# EAGLE design DigitalOut-02 (EAGLE 6.2)
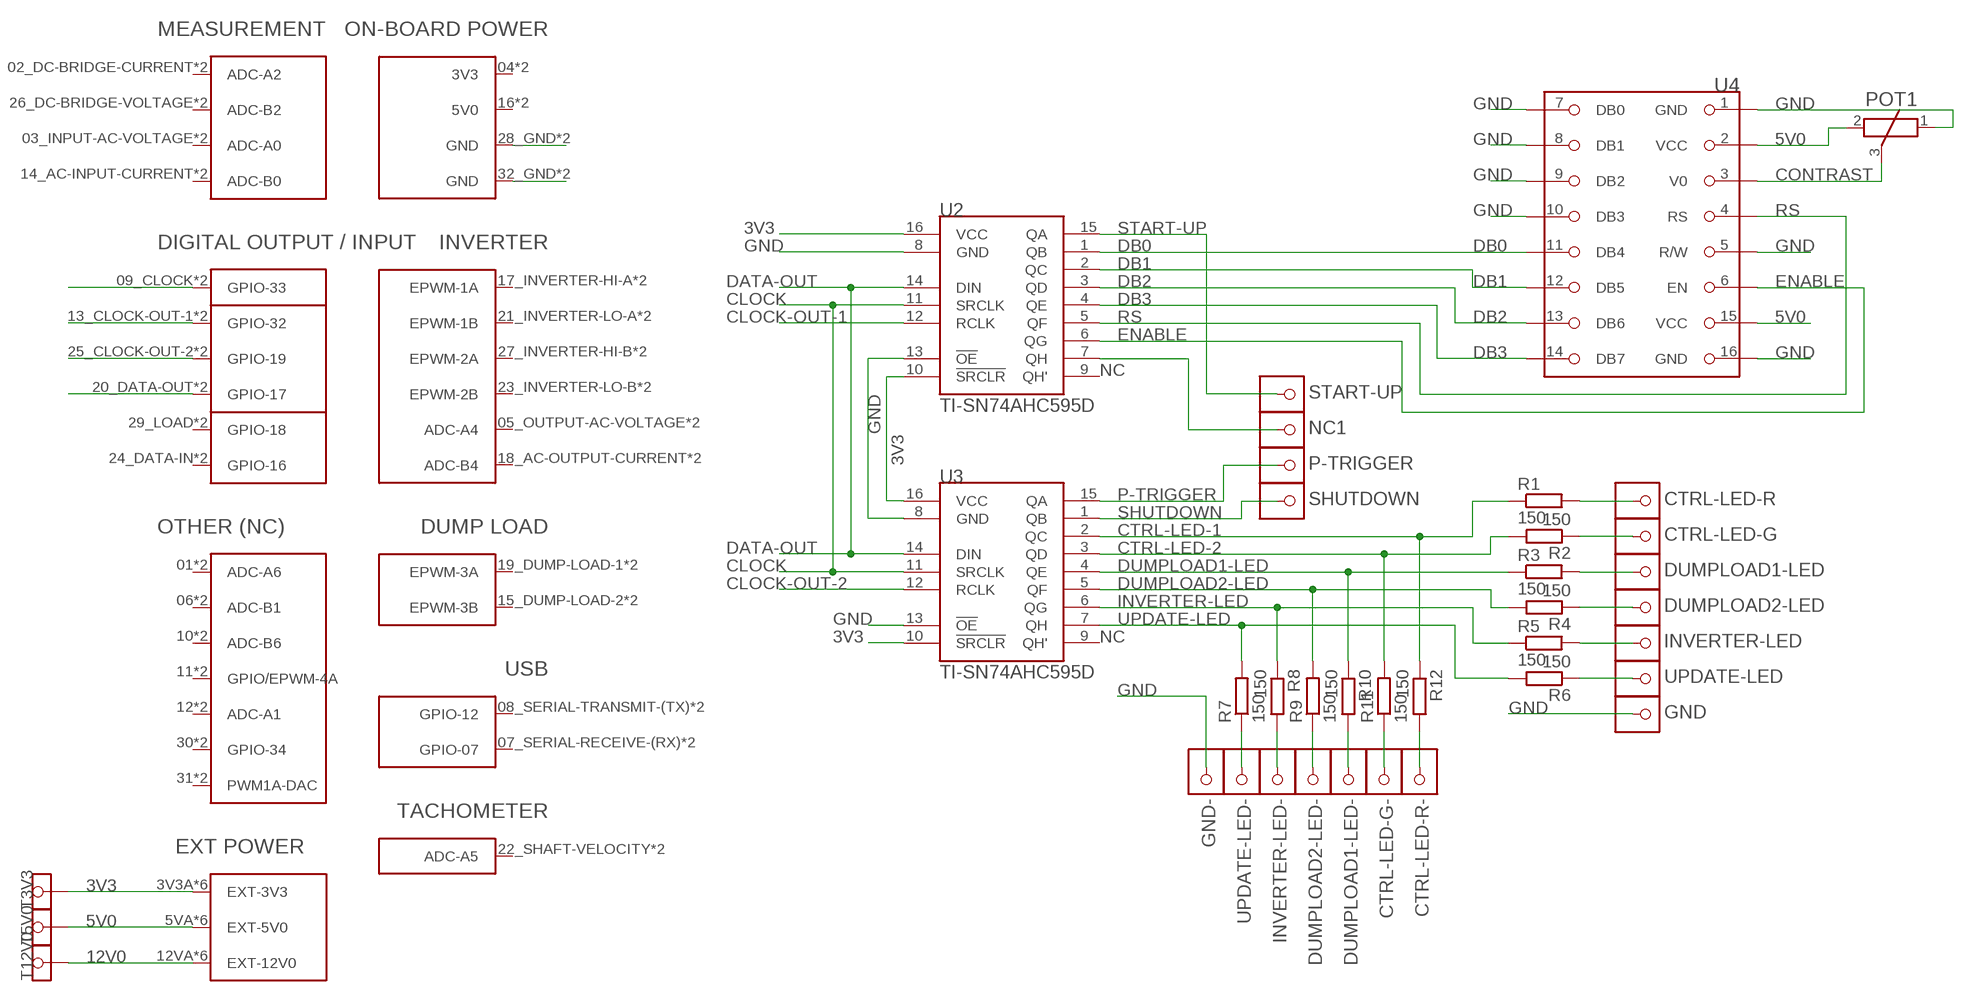
[diagram p0: schematic, sheet 1]

## Parts
CTRL-LED-G  1X1HEADER(W/VIA)  [1X1HEADER(W/VIA)]
CTRL-LED-G-  1X1HEADER  [1X1HEADER]
CTRL-LED-R  1X1HEADER(W/VIA)  [1X1HEADER(W/VIA)]
CTRL-LED-R-  1X1HEADER  [1X1HEADER]
DUMPLOAD1-LED  1X1HEADER(W/VIA)  [1X1HEADER(W/VIA)]
DUMPLOAD1-LED-  1X1HEADER  [1X1HEADER]
DUMPLOAD2-LED  1X1HEADER(W/VIA)  [1X1HEADER(W/VIA)]
DUMPLOAD2-LED-  1X1HEADER  [1X1HEADER]
GND  1X1HEADER(W/VIA)  [1X1HEADER(W/VIA)]
GND-  1X1HEADER  [1X1HEADER]
INVERTER-LED  1X1HEADER(W/VIA)  [1X1HEADER(W/VIA)]
INVERTER-LED-  1X1HEADER  [1X1HEADER]
NC1  1X1HEADER(W/VIA)  [1X1HEADER(W/VIA)]
P-TRIGGER  1X1HEADER(W/VIA)  [1X1HEADER(W/VIA)]
POT1  BOURNS-3361S  [BOURNS-3361S]
R1  150  R-EU_R0805  [R0805]
R2  150  R-EU_R0805  [R0805]
R3  150  R-EU_R0805  [R0805]
R4  150  R-EU_R0805  [R0805]
R5  150  R-EU_R0805  [R0805]
R6  150  R-EU_R0805  [R0805]
R7  150  R-EU_R0805  [R0805]
R8  150  R-EU_R0805  [R0805]
R9  150  R-EU_R0805  [R0805]
R10  150  R-EU_R0805  [R0805]
R11  150  R-EU_R0805  [R0805]
R12  150  R-EU_R0805  [R0805]
SHUTDOWN  1X1HEADER(W/VIA)  [1X1HEADER(W/VIA)]
START-UP  1X1HEADER(W/VIA)  [1X1HEADER(W/VIA)]
T3V3  TESTPAD  [TESTPAD]
T5V0  TESTPAD  [TESTPAD]
T12V0  TESTPAD  [TESTPAD]
U1  CONTROLLER_STACK  [CONTROLLER_STACK]
U2  TI-SN74AHC595D  [SOIC-16D]
U3  TI-SN74AHC595D  [SOIC-16D]
U4  MULTICOMP-MC9B232  [MULTICOMP-MC9B232]
UPDATE-LED  1X1HEADER(W/VIA)  [1X1HEADER(W/VIA)]
UPDATE-LED-  1X1HEADER  [1X1HEADER]

## Nets
3V3: T3V3.TP U1.3V3A(EXT-3V3) U1.3V3B(EXT-3V3) U1.3V3C(EXT-3V3) U1.3V3D(EXT-3V3) U1.3V3E(EXT-3V3) U1.3V3F(EXT-3V3) U2.10(!SRCLR) U2.16(VCC) U3.10(!SRCLR) U3.16(VCC)
5V0: POT1.2 T5V0.TP U1.5VA(EXT-5V0) U1.5VB(EXT-5V0) U1.5VC(EXT-5V0) U1.5VD(EXT-5V0) U1.5VE(EXT-5V0) U1.5VF(EXT-5V0) U4.2(VCC) U4.15(VCC)
12V0: T12V0.TP U1.12VA(EXT-12V0) U1.12VB(EXT-12V0) U1.12VC(EXT-12V0) U1.12VD(EXT-12V0) U1.12VE(EXT-12V0) U1.12VF(EXT-12V0)
CLOCK: U1.09_CLOCK(GPIO-33) U1.C9(GPIO-33) U2.11(SRCLK) U3.11(SRCLK)
CLOCK-OUT-1: U1.13_CLOCK-OUT-1(GPIO-32) U1.C13(GPIO-32) U2.12(RCLK)
CLOCK-OUT-2: U1.25_CLOCK-OUT-2(GPIO-19) U1.C25(GPIO-19) U3.12(RCLK)
CONTRAST: POT1.3 U4.3(V0)
CTRL-LED-1: R1.1 R12.1 U3.2(QC)
CTRL-LED-2: R2.2 R11.2 U3.3(QD)
DATA-OUT: U1.20_DATA-OUT(GPIO-17) U1.C20(GPIO-17) U2.14(DIN) U3.14(DIN)
DB0: U2.1(QB) U4.11(DB4)
DB1: U2.2(QC) U4.12(DB5)
DB2: U2.3(QD) U4.13(DB6)
DB3: U2.4(QE) U4.14(DB7)
DUMPLOAD1-LED: R3.1 R10.1 U3.4(QE)
DUMPLOAD2-LED: R4.2 R9.2 U3.5(QF)
ENABLE: U2.6(QG) U4.6(EN)
GND: GND-.P$1 GND.P$2 GND.P$3 GND.P$4 GND.PAD POT1.1 U1.28_GND(GND) U1.32_GND(GND) U1.C28(GND) U1.C32(GND) U2.8(GND) U2.13(!OE) U3.8(GND) U3.13(!OE) U4.1(GND) U4.5(R/W) U4.7(DB0) U4.8(DB1) U4.9(DB2) U4.10(DB3) U4.16(GND)
INVERTER-LED: R5.1 R8.1 U3.6(QG)
N$1: R7.1 UPDATE-LED-.P$1
N$2: INVERTER-LED-.P$1 R8.2
N$7: DUMPLOAD2-LED-.P$1 R9.1
N$8: DUMPLOAD1-LED-.P$1 R10.2
N$9: CTRL-LED-G-.P$1 R11.1
N$10: CTRL-LED-R.P$2 CTRL-LED-R.P$3 CTRL-LED-R.P$4 CTRL-LED-R.PAD R1.2
N$11: CTRL-LED-R-.P$1 R12.2
N$12: CTRL-LED-G.P$2 CTRL-LED-G.P$3 CTRL-LED-G.P$4 CTRL-LED-G.PAD R2.1
N$13: DUMPLOAD1-LED.P$2 DUMPLOAD1-LED.P$3 DUMPLOAD1-LED.P$4 DUMPLOAD1-LED.PAD R3.2
N$14: DUMPLOAD2-LED.P$2 DUMPLOAD2-LED.P$3 DUMPLOAD2-LED.P$4 DUMPLOAD2-LED.PAD R4.1
N$15: NC1.P$2 NC1.P$3 NC1.P$4 NC1.PAD U2.7(QH)
N$16: INVERTER-LED.P$2 INVERTER-LED.P$3 INVERTER-LED.P$4 INVERTER-LED.PAD R5.2
N$17: R6.1 UPDATE-LED.P$2 UPDATE-LED.P$3 UPDATE-LED.P$4 UPDATE-LED.PAD
P-TRIGGER: P-TRIGGER.P$2 P-TRIGGER.P$3 P-TRIGGER.P$4 P-TRIGGER.PAD U3.15(QA)
RS: U2.5(QF) U4.4(RS)
SHUTDOWN: SHUTDOWN.P$2 SHUTDOWN.P$3 SHUTDOWN.P$4 SHUTDOWN.PAD U3.1(QB)
START-UP: START-UP.P$2 START-UP.P$3 START-UP.P$4 START-UP.PAD U2.15(QA)
UPDATE-LED: R6.2 R7.2 U3.7(QH)
Unconnected: U1.01(ADC-A6) U1.02_DC-BRIDGE-CURRENT(ADC-A2) U1.03_INPUT-AC-VOLTAGE(ADC-A0) U1.04(3V3) U1.05_OUTPUT-AC-VOLTAGE(ADC-A4) U1.06(ADC-B1) U1.07_SERIAL-RECEIVE-(RX)(GPIO-07) U1.08_SERIAL-TRANSMIT-(TX)(GPIO-12) U1.10(ADC-B6) U1.11(GPIO/EPWM-4A) U1.12(ADC-A1) U1.14_AC-INPUT-CURRENT(ADC-B0) U1.15_DUMP-LOAD-2(EPWM-3B) U1.16(5V0) U1.17_INVERTER-HI-A(EPWM-1A) U1.18_AC-OUTPUT-CURRENT(ADC-B4) U1.19_DUMP-LOAD-1(EPWM-3A) U1.21_INVERTER-LO-A(EPWM-1B) U1.22_SHAFT-VELOCITY(ADC-A5) U1.23_INVERTER-LO-B(EPWM-2B) U1.24_DATA-IN(GPIO-16) U1.26_DC-BRIDGE-VOLTAGE(ADC-B2) U1.27_INVERTER-HI-B(EPWM-2A) U1.29_LOAD(GPIO-18) U1.30(GPIO-34) U1.31(PWM1A-DAC) U1.C1(ADC-A6) U1.C2(ADC-A2) U1.C3(ADC-A0) U1.C4(3V3) U1.C5(ADC-A4) U1.C6(ADC-B1) U1.C7(GPIO-07) U1.C8(GPIO-12) U1.C10(ADC-B6) U1.C11(GPIO/EPWM-4A) U1.C12(ADC-A1) U1.C14(ADC-B0) U1.C15(EPWM-3B) U1.C16(5V0) U1.C17(EPWM-1A) U1.C18(ADC-B4) U1.C19(EPWM-3A) U1.C21(EPWM-1B) U1.C22(ADC-A5) U1.C23(EPWM-2B) U1.C24(GPIO-16) U1.C26(ADC-B2) U1.C27(EPWM-2A) U1.C29(GPIO-18) U1.C30(GPIO-34) U1.C31(PWM1A-DAC) U2.9(QH') U3.9(QH')

## Notes on the sheet
- NC
- NC

## Library data of the parts
CTRL-LED-G CTRL-LED-R DUMPLOAD1-LED DUMPLOAD2-LED GND INVERTER-LED NC1 P-TRIGGER SHUTDOWN START-UP UPDATE-LED = headers v6-2:1X1HEADER(W/VIA)
CTRL-LED-G- CTRL-LED-R- DUMPLOAD1-LED- DUMPLOAD2-LED- GND- INVERTER-LED- UPDATE-LED- = headers v6-2:1X1HEADER: Standard 1x1way male/female header. 2.54mm pitch. Through-Hole. Use to create custom length headers by stacking.
POT1 = PCB_ControlStack:BOURNS-3361S
R1-R12 = resistor:R-EU_: RESISTOR, European symbol
T3V3 T5V0 T12V0 = PCB_ControlStack:TESTPAD
U1 = PCB_ControlStack:CONTROLLER_STACK
U2 U3 = PCB_ControlStack:TI-SN74AHC595D: Texas Instruments SN74HC595D Serial-to-Parallel Shift Register, 8 bit with storage register, Tri-state
U4 = PCB_ControlStack:MULTICOMP-MC9B232: A shrouded lock header for LCD screen interfacing. 2.54mm pitch.

## Board
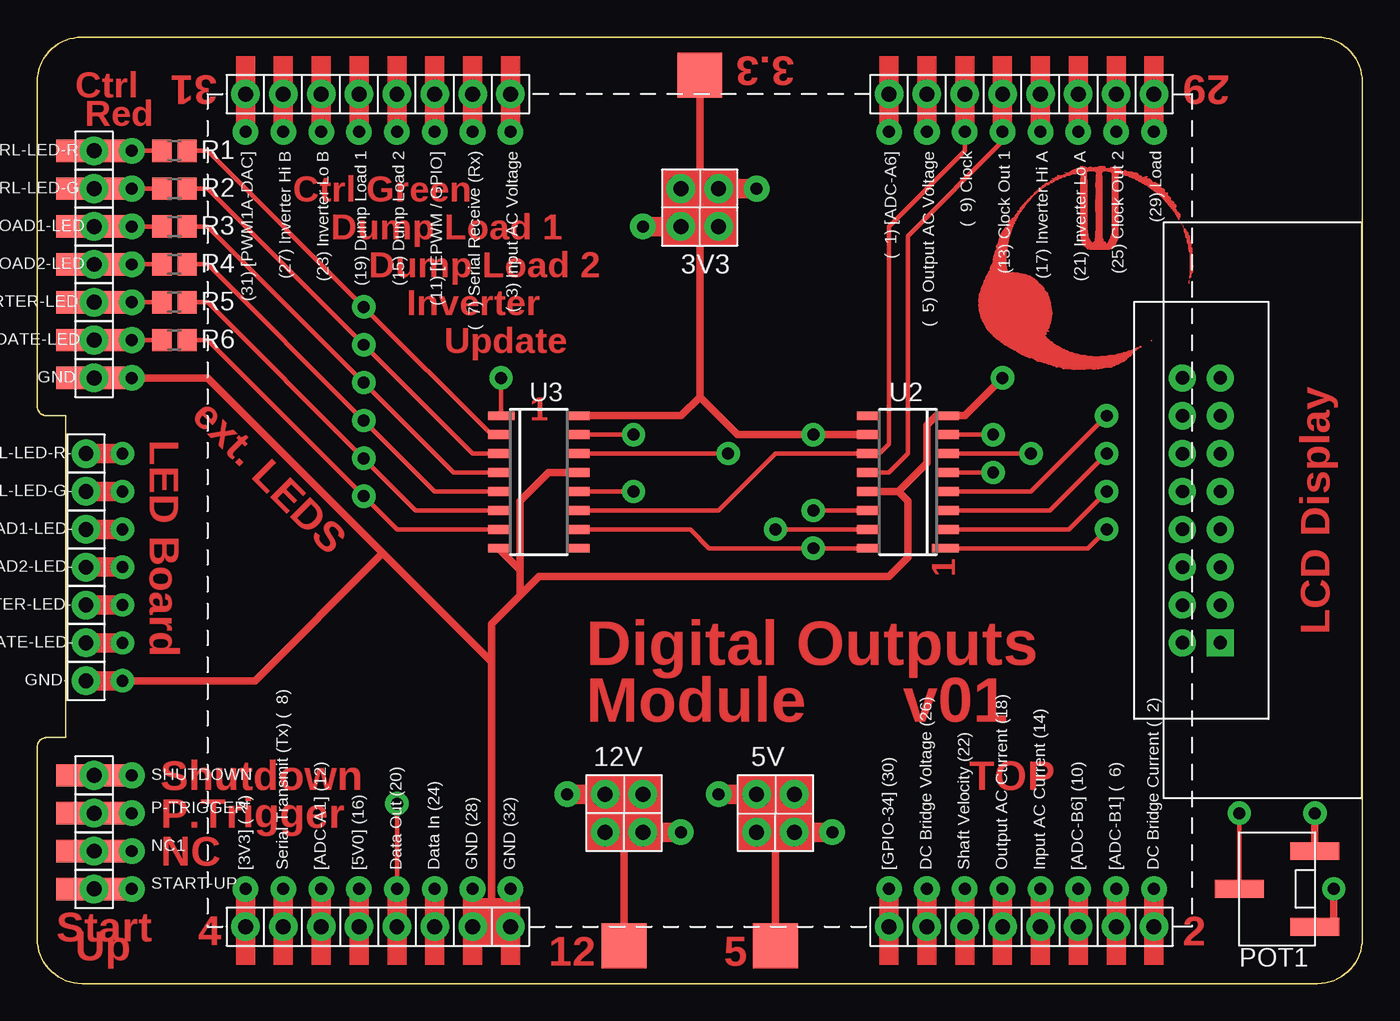
[diagram p1: board, top side]
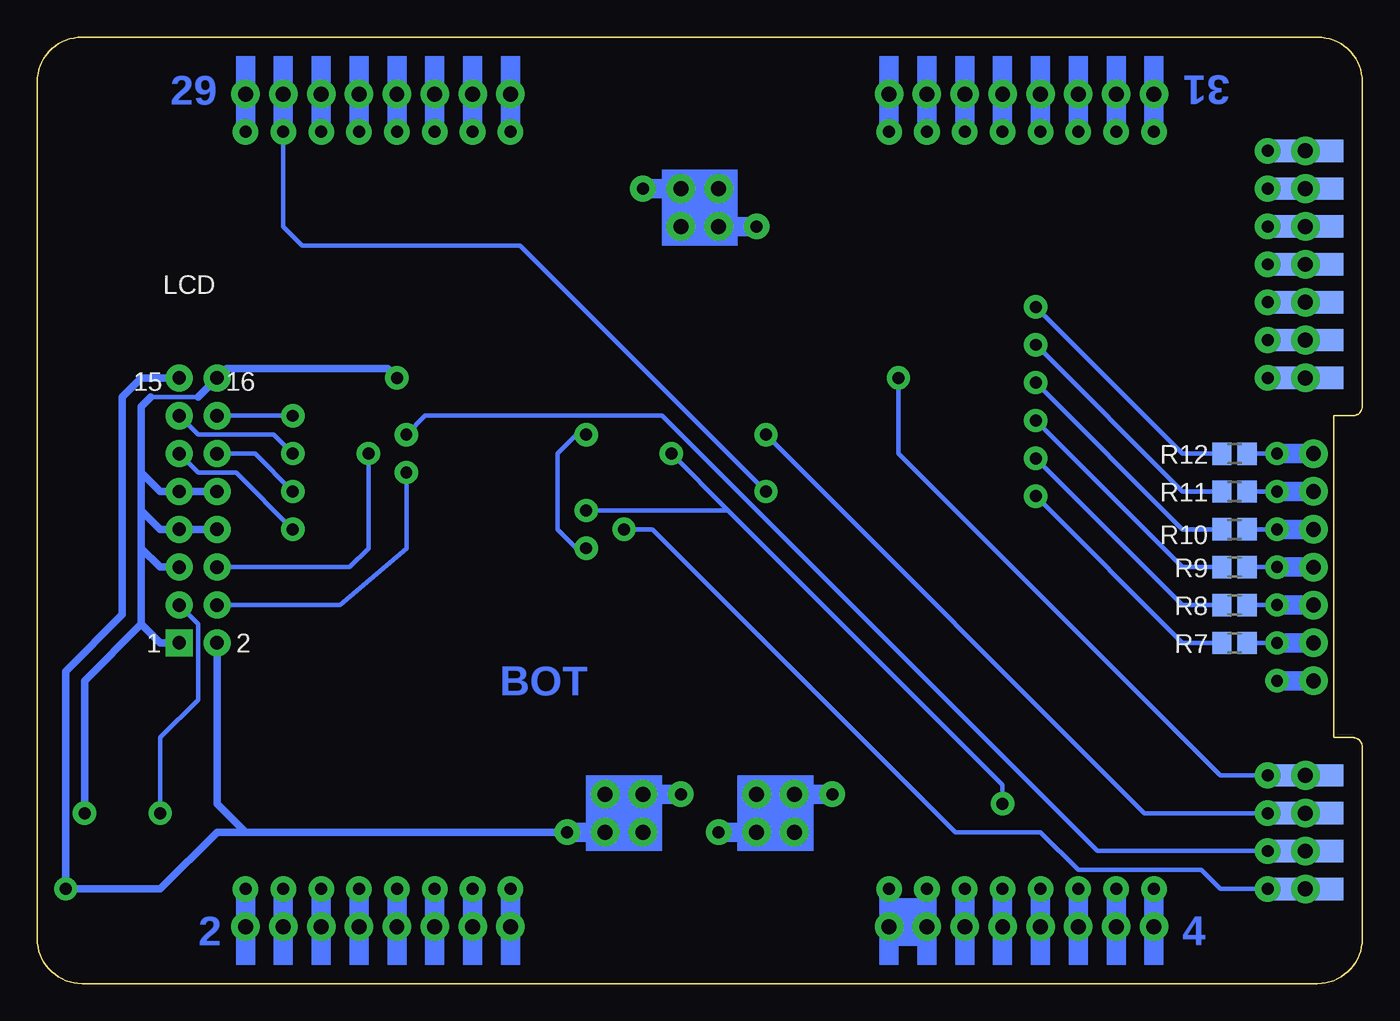
[diagram p2: board, bottom side, seen from below]

Size 88.9 x 63.5 mm. Coordinates in mm from the lower left corner, seen from the top.
Outline: 3,0 85.9,0 arc90 88.9,3 88.9,60.5 arc90 85.9,63.5 3,63.5 arc90 0,60.5 0,38.73 arc90 0.64,38.1 1.91,38.1 1.91,16.51 0.64,16.51 arc90 0,15.88 0,3 arc90 3,0
Copper layers (1*16): Top 0.035mm / dielectric 1.5mm / Bottom 0.035mm
Design rules: minimum track width 12mil, minimum drill 0.7mm, track to track 25mil, track to pad 20mil, pad to pad 15mil, via to via 20mil, smd to smd 0mil, copper to edge 30mil, drill to drill 10mil, minimum pad ring 18mil, minimum via ring 15mil, stop-mask expansion 0mil, vias tented up to drill 0mil, thermal gap 15mil
tRestrict: 8 lines
bRestrict: 8 lines

### Footprints (pad centres in the part's own frame; a part is rotated, then mirrored left to right if it is on the bottom)
1X1HEADER(W/VIA) = smd 5.08 x 1.5: P$2 0,0 | smd 5.08 x 1.5 bottom: P$3 0,0 | drill 0.8: P$4 2.54,0 | drill 1: PAD 0,0
1X1HEADER = drill 1: P$1 0,0
BOURNS-3361S = smd 1.19 x 3.3: 1 2.54,-1.27; 2 -2.54,-1.27; 3 0,3.81
R0805 = smd 1.3 x 1.5: 1 -0.85,0; 2 0.85,0
TESTPAD = smd 3 x 3: TP 0,0
CONTROLLER_STACK = drill 1: 01 -27.94,12.7; 02_DC-BRIDGE-CURRENT 27.94,30.48; 03_INPUT-AC-VOLTAGE -27.94,-12.7; 3V3B -21.59,-1.27; 3V3C -21.59,1.27; 3V3E -19.05,1.27; 3V3F -19.05,-1.27; 04 27.94,-30.48; 05_OUTPUT-AC-VOLTAGE -27.94,15.24; 5VB 19.05,3.81; 5VC 19.05,6.35; 5VE 21.59,6.35; 5VF 21.59,3.81; 06 27.94,27.94; 07_SERIAL-RECEIVE-(RX) -27.94,-15.24; 08_SERIAL-TRANSMIT-(TX) 27.94,-27.94; 09_CLOCK -27.94,17.78; 10 27.94,25.4; 11 -27.94,-17.78; 12 27.94,-25.4; 12VB 19.05,-6.35; 12VC 19.05,-3.81; 12VE 21.59,-3.81; 12VF 21.59,-6.35; 13_CLOCK-OUT-1 -27.94,20.32; 14_AC-INPUT-CURRENT 27.94,22.86; 15_DUMP-LOAD-2 -27.94,-20.32; 16 27.94,-22.86; 17_INVERTER-HI-A -27.94,22.86; 18_AC-OUTPUT-CURRENT 27.94,20.32; 19_DUMP-LOAD-1 -27.94,-22.86; 20_DATA-OUT 27.94,-20.32; 21_INVERTER-LO-A -27.94,25.4; 22_SHAFT-VELOCITY 27.94,17.78; 23_INVERTER-LO-B -27.94,-25.4; 24_DATA-IN 27.94,-17.78; 25_CLOCK-OUT-2 -27.94,27.94; 26_DC-BRIDGE-VOLTAGE 27.94,15.24; 27_INVERTER-HI-B -27.94,-27.94; 28_GND 27.94,-15.24; 29_LOAD -27.94,30.48; 30 27.94,12.7; 31 -27.94,-30.48; 32_GND 27.94,-12.7 | drill 0.8: 3V3A -21.59,3.81; 3V3D -19.05,-3.81; 5VA 19.05,1.27; 5VD 21.59,8.89; 12VA 19.05,-8.89; 12VD 21.59,-1.27; C1 -25.4,12.7; C2 25.4,30.48; C3 -25.4,-12.7; C4 25.4,-30.48; C5 -25.4,15.24; C6 25.4,27.94; C7 -25.4,-15.24; C8 25.4,-27.94; C9 -25.4,17.78; C10 25.4,25.4; C11 -25.4,-17.78; C12 25.4,-25.4; C13 -25.4,20.32; C14 25.4,22.86; C15 -25.4,-20.32; C16 25.4,-22.86; C17 -25.4,22.86; C18 25.4,20.32; C19 -25.4,-22.86; C20 25.4,-20.32; C21 -25.4,25.4; C22 25.4,17.78; C23 -25.4,-25.4; C24 25.4,-17.78; C25 -25.4,27.94; C26 25.4,15.24; C27 -25.4,-27.94; C28 25.4,-15.24; C29 -25.4,30.48; C30 25.4,12.7; C31 -25.4,-30.48; C32 25.4,-12.7
SOIC-16D = smd 0.6 x 1.8: 1 -4.445,-2.515 | smd 0.6 x 1.4: 2 -3.175,-2.715; 3 -1.905,-2.715; 4 -0.635,-2.715; 5 0.635,-2.715; 6 1.905,-2.715; 7 3.175,-2.715; 8 4.445,-2.715; 9 4.445,2.715; 10 3.175,2.715; 11 1.905,2.715; 12 0.635,2.715; 13 -0.635,2.715; 14 -1.905,2.715; 15 -3.175,2.715; 16 -4.445,2.715
MULTICOMP-MC9B232 = drill 0.9 pad 1.4 square: 1 1.27,-8.89 | drill 0.9 pad 1.4: 2 -1.27,-8.89; 3 1.27,-6.35; 4 -1.27,-6.35; 5 1.27,-3.81; 6 -1.27,-3.81; 7 1.27,-1.27; 8 -1.27,-1.27; 9 1.27,1.27; 10 -1.27,1.27; 11 1.27,3.81; 12 -1.27,3.81; 13 1.27,6.35; 14 -1.27,6.35; 15 1.27,8.89; 16 -1.27,8.89

### Placement (x,y rotation side)
CTRL-LED-G  3.81,53.34 0 top
CTRL-LED-G-  3.27,33.02 0 top
CTRL-LED-R  3.81,55.88 0 top
CTRL-LED-R-  3.27,35.56 0 top
DUMPLOAD1-LED  3.81,50.8 0 top
DUMPLOAD1-LED-  3.27,30.48 0 top
DUMPLOAD2-LED  3.81,48.26 0 top
DUMPLOAD2-LED-  3.27,27.94 0 top
GND  3.81,40.64 0 top
GND-  3.27,20.32 0 top
INVERTER-LED  3.81,45.72 0 top
INVERTER-LED-  3.27,25.4 0 top
NC1  3.81,8.89 0 top
P-TRIGGER  3.81,11.43 0 top
POT1  84.45,6.35 90 top
R1  9.21,55.88 180 top
R2  9.21,53.34 0 top
R3  9.21,50.8 180 top
R4  9.21,48.26 0 top
R5  9.21,45.72 180 top
R6  9.21,43.18 0 top
R7  8.57,22.86 180 bottom
R8  8.57,25.4 0 bottom
R9  8.57,27.94 180 bottom
R10  8.57,30.48 0 bottom
R11  8.57,33.02 180 bottom
R12  8.57,35.56 0 bottom
SHUTDOWN  3.81,13.97 0 top
START-UP  3.81,6.35 0 top
T3V3  44.45,60.96 0 top
T5V0  49.53,2.54 180 top
T12V0  39.37,2.54 180 top
U1  44.45,31.75 270 top
U2  58.42,33.66 90 top
U3  33.66,33.66 270 top
U4  78.11,31.75 0 top
UPDATE-LED  3.81,43.18 0 top
UPDATE-LED-  3.27,22.86 0 top

### Tracks (layer width: path | path; a pad name or v marks a point on that pad's centre or on a via)
3V3  (via drill 0.8)
  Top 0.3: U3.10 43.81,30.48 45.09,29.21 v52.07,29.21 U2.16 55.88,29.21
  Top 0.5: U1.3V3D U1.3V3F U1.3V3B 44.45,53.34 | 44.45,53.34 U1.3V3C | U1.3V3C U1.3V3E | U1.3V3C U1.3V3A | T3V3.TP 44.45,53.34 | 44.45,39.37 44.45,53.34 | 44.45,39.37 43.18,38.1 U3.16 | 44.45,39.37 46.99,36.83 v52.07,36.83 U2.10
  Bottom 0.3: v52.07,36.83 52.7,36.83 53.98,35.56 53.98,30.48 52.7,29.21 v52.07,29.21
5V0  (via drill 0.8)
  Top 0.5: U1.5VF 49.53,10.16 | 49.53,10.16 U1.5VE | U1.5VE U1.5VC U1.5VB U1.5VA | U1.5VE U1.5VD | T5V0.TP 49.53,10.16 | POT1.2 87,3.81 v87,6.35
  Bottom 0.5: 74.93,10.16 76.83,10.16 80.64,6.35 v87,6.35 87,20.95 83.19,24.77 83.19,39.37 81.92,40.64 U4.15 | 74.93,10.16 U1.5VD | U4.2 76.83,12.06 74.93,10.16
12V0
  Top 0.5: U1.12VA U1.12VB U1.12VC U1.12VE | U1.12VE 39.37,10.16 | 39.37,10.16 U1.12VF | U1.12VE U1.12VD | T12V0.TP 39.37,10.16
CLOCK
  Top 0.3: U1.09_CLOCK U1.C9 62.23,55.88 57.15,50.8 57.15,36.2 56.52,35.56 U2.11 49.53,35.56 45.72,31.75 U3.11
CLOCK-OUT-1
  Top 0.3: U1.13_CLOCK-OUT-1 U1.C13 64.77,56.52 58.42,50.16 58.42,35.56 57.15,34.29 U2.12
CLOCK-OUT-2  (via drill 0.8)
  Top 0.3: U1.25_CLOCK-OUT-2 U1.C25 | U3.12 v40.01,33.02
  Bottom 0.3: U1.C25 72.39,50.8 71.12,49.53 56.52,49.53 v40.01,33.02
CONTRAST  (via drill 0.8)
  Top 0.3: POT1.3 v80.64,11.43
  Bottom 0.3: v80.64,11.43 80.64,16.51 78.11,19.05 78.11,24.13 U4.3
CTRL-LED-1  (via drill 0.8)
  Top 0.3: R1.1 11.43,55.88 v21.91,45.4 30.48,36.83 U3.2
  Bottom 0.3: v21.91,45.4 12.06,35.56 R12.1
CTRL-LED-2  (via drill 0.8)
  Top 0.3: R2.2 11.43,53.34 v21.91,42.86 29.21,35.56 U3.3
  Bottom 0.3: v21.91,42.86 12.06,33.02 R11.2
DATA-OUT  (via drill 0.8)
  Top 0.3: U1.20_DATA-OUT U1.C20 v24.13,12.06 | U3.14 v46.35,35.56 | U2.14 v52.07,31.75
  Bottom 0.3: v24.13,12.06 24.13,13.34 42.55,31.75 | v52.07,31.75 42.55,31.75 | 42.55,31.75 v46.35,35.56
DB0  (via drill 0.8)
  Top 0.3: U2.1 70.48,29.21 v71.75,30.48
  Bottom 0.3: U4.11 78.11,34.29 75.56,34.29 v71.75,30.48
DB1  (via drill 0.8)
  Top 0.3: U2.2 69.22,30.48 v71.75,33.02
  Bottom 0.3: v71.75,33.02 74.3,35.56 U4.12
DB2  (via drill 0.8)
  Top 0.3: U2.3 66.67,31.75 67.31,31.75 67.94,31.75 v71.75,35.56
  Bottom 0.3: U4.13 78.11,36.83 73.03,36.83 v71.75,35.56
DB3  (via drill 0.8)
  Top 0.3: U2.4 66.67,33.02 v71.75,38.1
  Bottom 0.3: v71.75,38.1 U4.14
DUMPLOAD1-LED  (via drill 0.8)
  Top 0.3: R3.1 11.43,50.8 v21.91,40.32 27.94,34.29 U3.4
  Bottom 0.3: v21.91,40.32 12.06,30.48 R10.1
DUMPLOAD2-LED  (via drill 0.8)
  Top 0.3: R4.2 11.43,48.26 v21.91,37.78 26.67,33.02 U3.5
  Bottom 0.3: v21.91,37.78 12.06,27.94 R9.2
ENABLE  (via drill 0.8)
  Top 0.3: U2.6 v66.67,35.56
  Bottom 0.3: v66.67,35.56 66.67,29.21 67.94,27.94 U4.6
GND  (via drill 0.8)
  Top 0.3: GND.P$4 GND.P$3 | U1.C28 U1.28_GND 30.48,3.81 U1.32_GND U1.C32 | 60.33,38.1 U2.8
  Top 0.5: POT1.1 v85.72,11.43 | 57.78,33.02 59.69,34.92 59.69,37.47 60.33,38.1 | U3.13 34.29,34.29 32.38,32.38 32.38,27.94 32.3,27.85 | GND.P$4 11.43,40.64 23.18,28.89 | 30.48,21.59 30.48,3.81 | v5.71,20.32 14.61,20.32 23.18,28.89 | U2.13 57.78,33.02 | 57.78,33.02 58.42,32.38 58.42,28.57 57.15,27.3 33.66,27.3 32.38,26.04 | 32.38,26.04 32.38,27.77 32.3,27.85 | 32.3,27.85 U3.8 | 23.18,28.89 30.48,21.59 | 30.48,21.59 30.48,24.13 32.38,26.04 | U2.8 62.23,38.1 v64.77,40.64
  Bottom 0.3: v5.71,20.32 GND-.P$1 | 81.28,39.37 78.11,39.37
  Bottom 0.5: U4.5 80.64,27.94 81.92,29.21 | U4.1 80.64,22.86 81.92,24.13 | 81.92,24.13 81.92,29.21 | 81.92,29.21 81.92,31.75 | 81.92,31.75 81.92,34.29 | 81.92,34.29 81.92,38.73 81.28,39.37 | v85.72,11.43 85.72,20.32 81.92,24.13 | 81.92,31.75 80.64,30.48 U4.7 U4.8 | 81.92,34.29 80.64,33.02 U4.9 U4.10 | 78.11,39.37 U4.16 76.2,41.27 65.41,41.27 v64.77,40.64
INVERTER-LED  (via drill 0.8)
  Top 0.3: R5.1 11.43,45.72 v21.91,35.24 25.4,31.75 U3.6
  Bottom 0.3: v21.91,35.24 12.06,25.4 R8.1
N$1  (via drill 0.8)
  Top 0.3: v5.71,22.86 UPDATE-LED-.P$1
  Bottom 0.3: R7.1 v5.71,22.86
N$2  (via drill 0.8)
  Top 0.3: v5.71,25.4 INVERTER-LED-.P$1
  Bottom 0.3: R8.2 v5.71,25.4
N$7  (via drill 0.8)
  Top 0.3: v5.71,27.94 DUMPLOAD2-LED-.P$1
  Bottom 0.3: R9.1 v5.71,27.94
N$8  (via drill 0.8)
  Top 0.3: v5.71,30.48 DUMPLOAD1-LED-.P$1
  Bottom 0.3: R10.2 v5.71,30.48
N$9  (via drill 0.8)
  Top 0.3: v5.71,33.02 CTRL-LED-G-.P$1
  Bottom 0.3: R11.1 v5.71,33.02
N$10
  Top 0.3: R1.2 CTRL-LED-R.P$4 CTRL-LED-R.P$3
N$11  (via drill 0.8)
  Top 0.3: v5.71,35.56 CTRL-LED-R-.P$1
  Bottom 0.3: R12.2 v5.71,35.56
N$12
  Top 0.3: R2.1 CTRL-LED-G.P$4 CTRL-LED-G.P$3
N$13
  Top 0.3: R3.2 DUMPLOAD1-LED.P$4 DUMPLOAD1-LED.P$3
N$14
  Top 0.3: R4.1 DUMPLOAD2-LED.P$4 DUMPLOAD2-LED.P$3
N$15  (via drill 0.8)
  Top 0.3: U2.7 v64.14,36.83 | NC1.P$4 NC1.P$2
  Bottom 0.3: NC1.P$4 17.78,8.89 46.99,38.1 62.87,38.1 v64.14,36.83
N$16
  Top 0.3: R5.2 INVERTER-LED.P$4 INVERTER-LED.P$3
N$17
  Top 0.3: R6.1 UPDATE-LED.P$4 UPDATE-LED.P$3
P-TRIGGER  (via drill 0.8)
  Top 0.3: P-TRIGGER.P$4 P-TRIGGER.P$3 | v40.01,36.83 U3.15
  Bottom 0.3: P-TRIGGER.P$4 14.61,11.43 v40.01,36.83
RS  (via drill 0.8)
  Top 0.3: U2.5 v64.14,34.29
  Bottom 0.3: v64.14,34.29 64.14,29.21 68.58,25.4 U4.4
SHUTDOWN  (via drill 0.8)
  Top 0.3: SHUTDOWN.P$4 SHUTDOWN.P$3 | v31.11,40.64 31.11,38.12 U3.1
  Bottom 0.3: SHUTDOWN.P$4 9.53,13.97 31.11,35.56 v31.11,40.64
START-UP  (via drill 0.8)
  Top 0.3: START-UP.P$4 START-UP.P$2 | U2.15 v49.53,30.48
  Bottom 0.3: v49.53,30.48 47.62,30.48 27.3,10.16 21.59,10.16 19.05,7.62 10.79,7.62 9.53,6.35 START-UP.P$4
UPDATE-LED  (via drill 0.8)
  Top 0.3: R6.2 11.43,43.18 v21.91,32.7 24.13,30.48 U3.7
  Bottom 0.3: v21.91,32.7 12.06,22.86 R7.2
(copper drawn outside any net)
  shapes: Bottom area x8, Top area x1042

### Text on the board
Top: 3.3 | Ctrl | Red | Ctrl Green | Dump Load 1 | Dump Load 2 | Inverter | Update | 1 | ext. LEDS | LCD Display | LED Board | 1 | Digital Outputs | Module | v01 | Shutdown | TOP | P.Trigger | NC | Start | Up | 12 | 5
Bottom: BOT